# EAGLE design UCube_v2_02 (EAGLE 5.10)
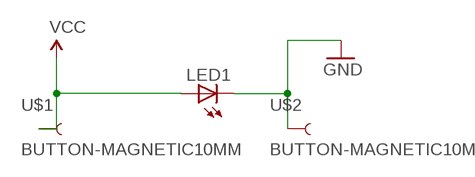
[diagram p0: schematic, sheet 1]

## Parts
LED1  LED5MM  [LED5MM]
U$1  BUTTON-MAGNETIC10MM  [BUTTON-10MM]
U$2  BUTTON-MAGNETIC10MM  [BUTTON-10MM]

## Nets
GND: LED1.K(C) U$2.1
VCC: LED1.A U$1.1

## Library data of the parts
LED1 = SparkFun2:LED: LEDs Standard schematic elements and footprints for 5mm, 3mm, 1206, and 0603 sized LEDs. 5mm - Spark Fun Electronics SKU : COM-00529 (and others)
U$1 U$2 = SparkFun2:BUTTON-MAGNETIC

## Board
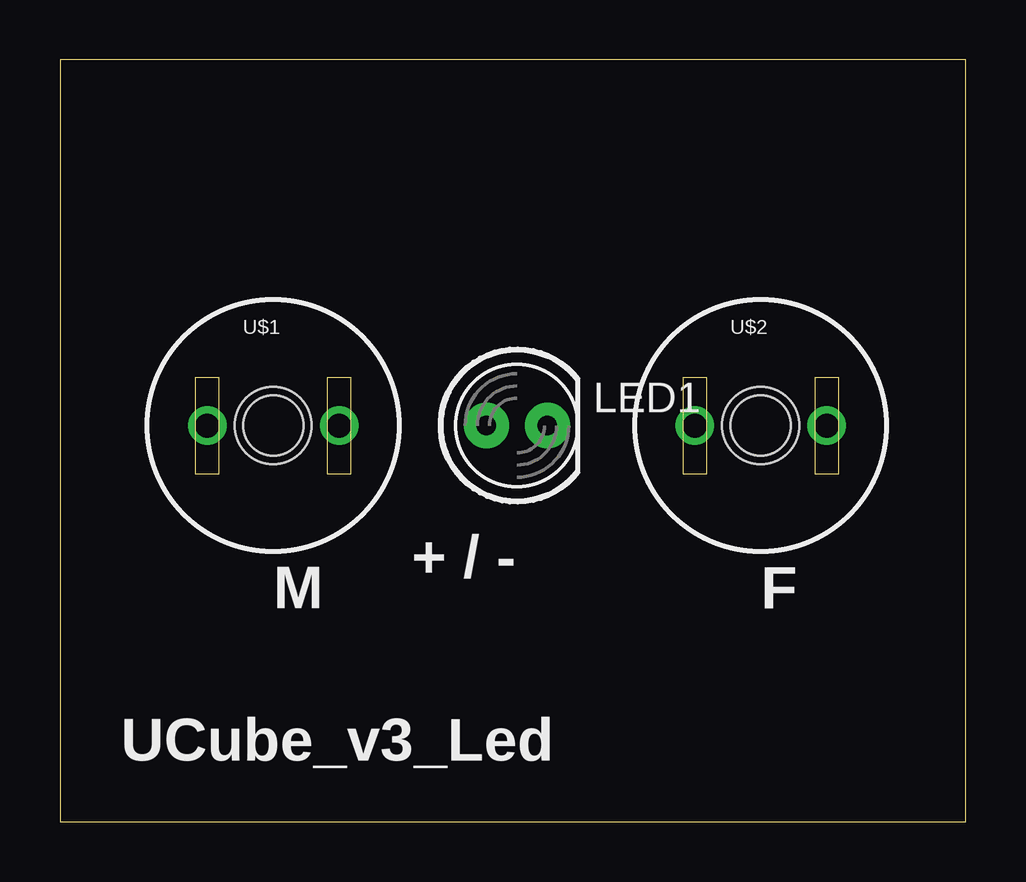
[diagram p1: board, top side]
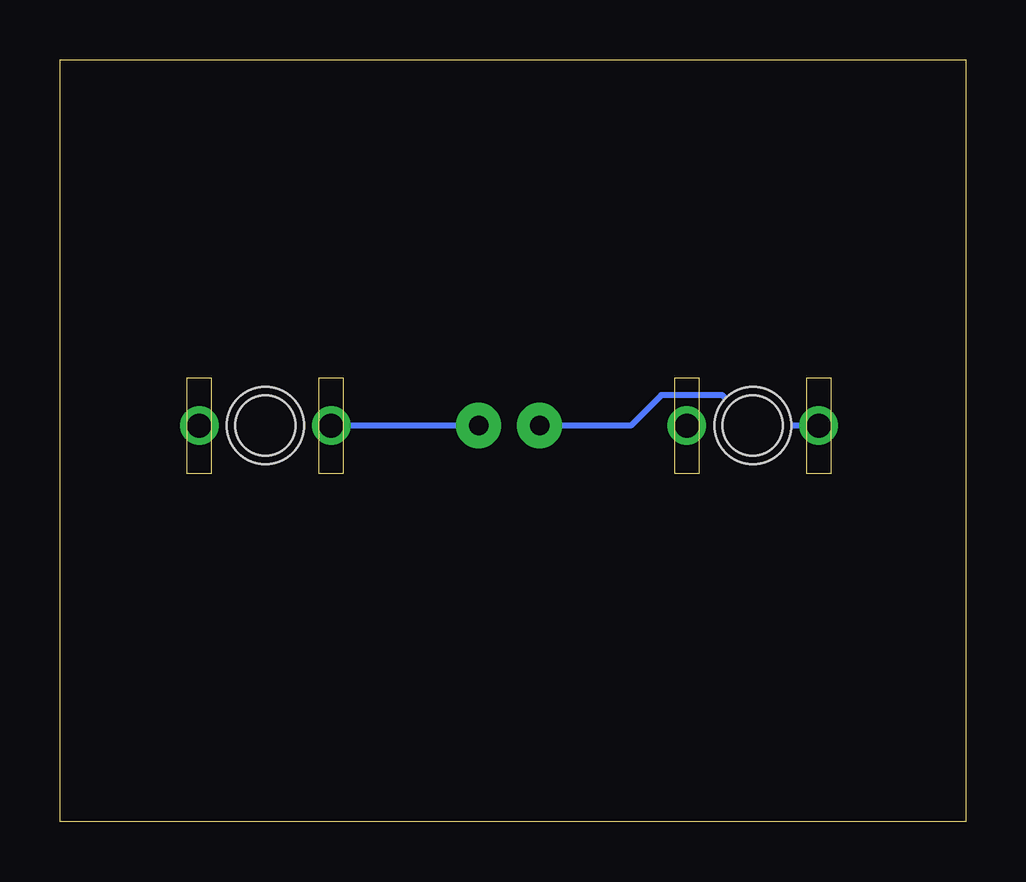
[diagram p2: board, bottom side, seen from below]

Size 37.77 x 31.74 mm. Coordinates in mm from the lower left corner, seen from the top.
Outline: 0,0 37.77,0 37.77,31.74 0,31.74 0,0
Copper layers (1*16): Top 0.035mm / dielectric 1.5mm / Bottom 0.035mm
Design rules: minimum track width 8mil, minimum drill 20mil, track to track 8mil, track to pad 8mil, pad to pad 8mil, via to via 8mil, smd to smd 8mil, copper to edge 10mil, drill to drill 8mil, minimum pad ring 12mil, minimum via ring 10mil, stop-mask expansion 4mil, vias tented up to drill 25mil, thermal gap 10mil
Holes 3.2 mm at 8.89,16.51 29.21,16.51

### Footprints (pad centres in the part's own frame; a part is rotated, then mirrored left to right if it is on the bottom)
LED5MM = drill 0.813 pad 1.88: A -1.27,0; K 1.27,0
BUTTON-10MM = drill 1: 1 -2.75,0; 2 2.75,0 | hole 2.5: 0,0

### Placement (x,y rotation side)
LED1  19.05,16.51 0 top
U$1  8.89,16.51 0 top
U$2  29.21,16.51 0 top

### Tracks (layer width: path | path; a pad name or v marks a point on that pad's centre or on a via)
GND
  Bottom 0.254: LED1.K U$2.1 26.67,16.51
VCC
  Bottom 0.254: LED1.A 13.97,16.51 12.7,17.78 10.16,17.78 8.89,16.51 U$1.1

### Text on the board
tPlace: + / - | M | F | UCube_v3_Led